# Altium schematic sheet BlockDiagram.SchDoc
size A4; SheetNumber: 1; SheetTotal: 22
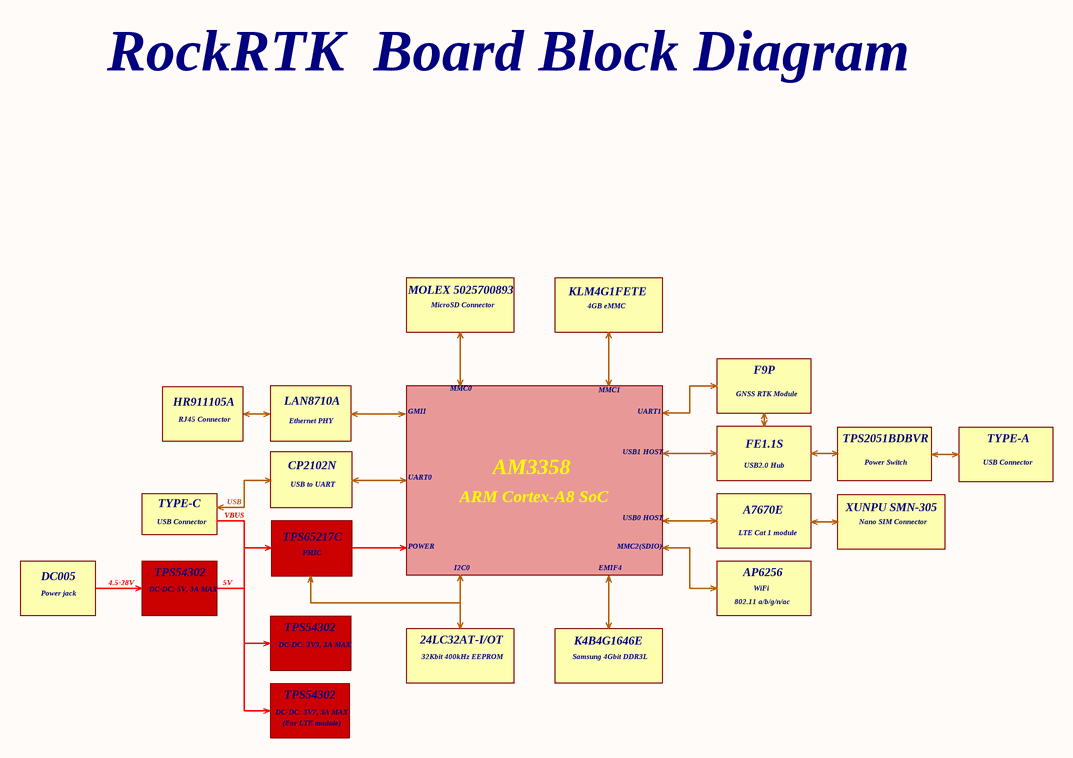
[diagram p0: BlockDiagram.SchDoc]

## Notes on the sheet
- RockRTK  Board Block Diagram
- MOLEX 5025700893
- MicroSD Connector
- KLM4G1FETE
- 4GB eMMC
- MMC0
- MMC1
- GNSS RTK Module
- F9P
- HR911105A
- RJ45 Connector
- LAN8710A
- CP2102N
- Ethernet PHY
- GMII
- AM3358
- USB1 HOST
- UART1
- USB2.0 Hub
- FE1.1S
- TPS2051BDBVR
- Power Switch
- USB Connector
- TYPE-A
- TYPE-C
- VBUS
- USB
- USB to UART
- UART0
- ARM Cortex-A8 SoC
- USB0 HOST
- LTE Cat 1 module
- A7670E
- XUNPU SMN-305
- Nano SIM Connector
- DC005
- Power jack
- 4.5-28V
- DC-DC: 5V, 3A MAX
- TPS54302
- 5V
- TPS65217C
- PMIC
- POWER
- I2C0
- EMIF4
- MMC2(SDIO)
- 802.11 a/b/g/n/ac
- AP6256
- WiFi
- DC-DC: 3V3, 3A MAX
- 24LC32AT-I/OT
- 32Kbit 400kHz EEPROM
- Samsung 4Gbit DDR3L
- K4B4G1646E
- DC-DC: 3V7, 3A MAX
- (For LTE module)